# Altium schematic sheet 10-JTAG.SchDoc
size C; SheetNumber: 10; SheetTotal: 20
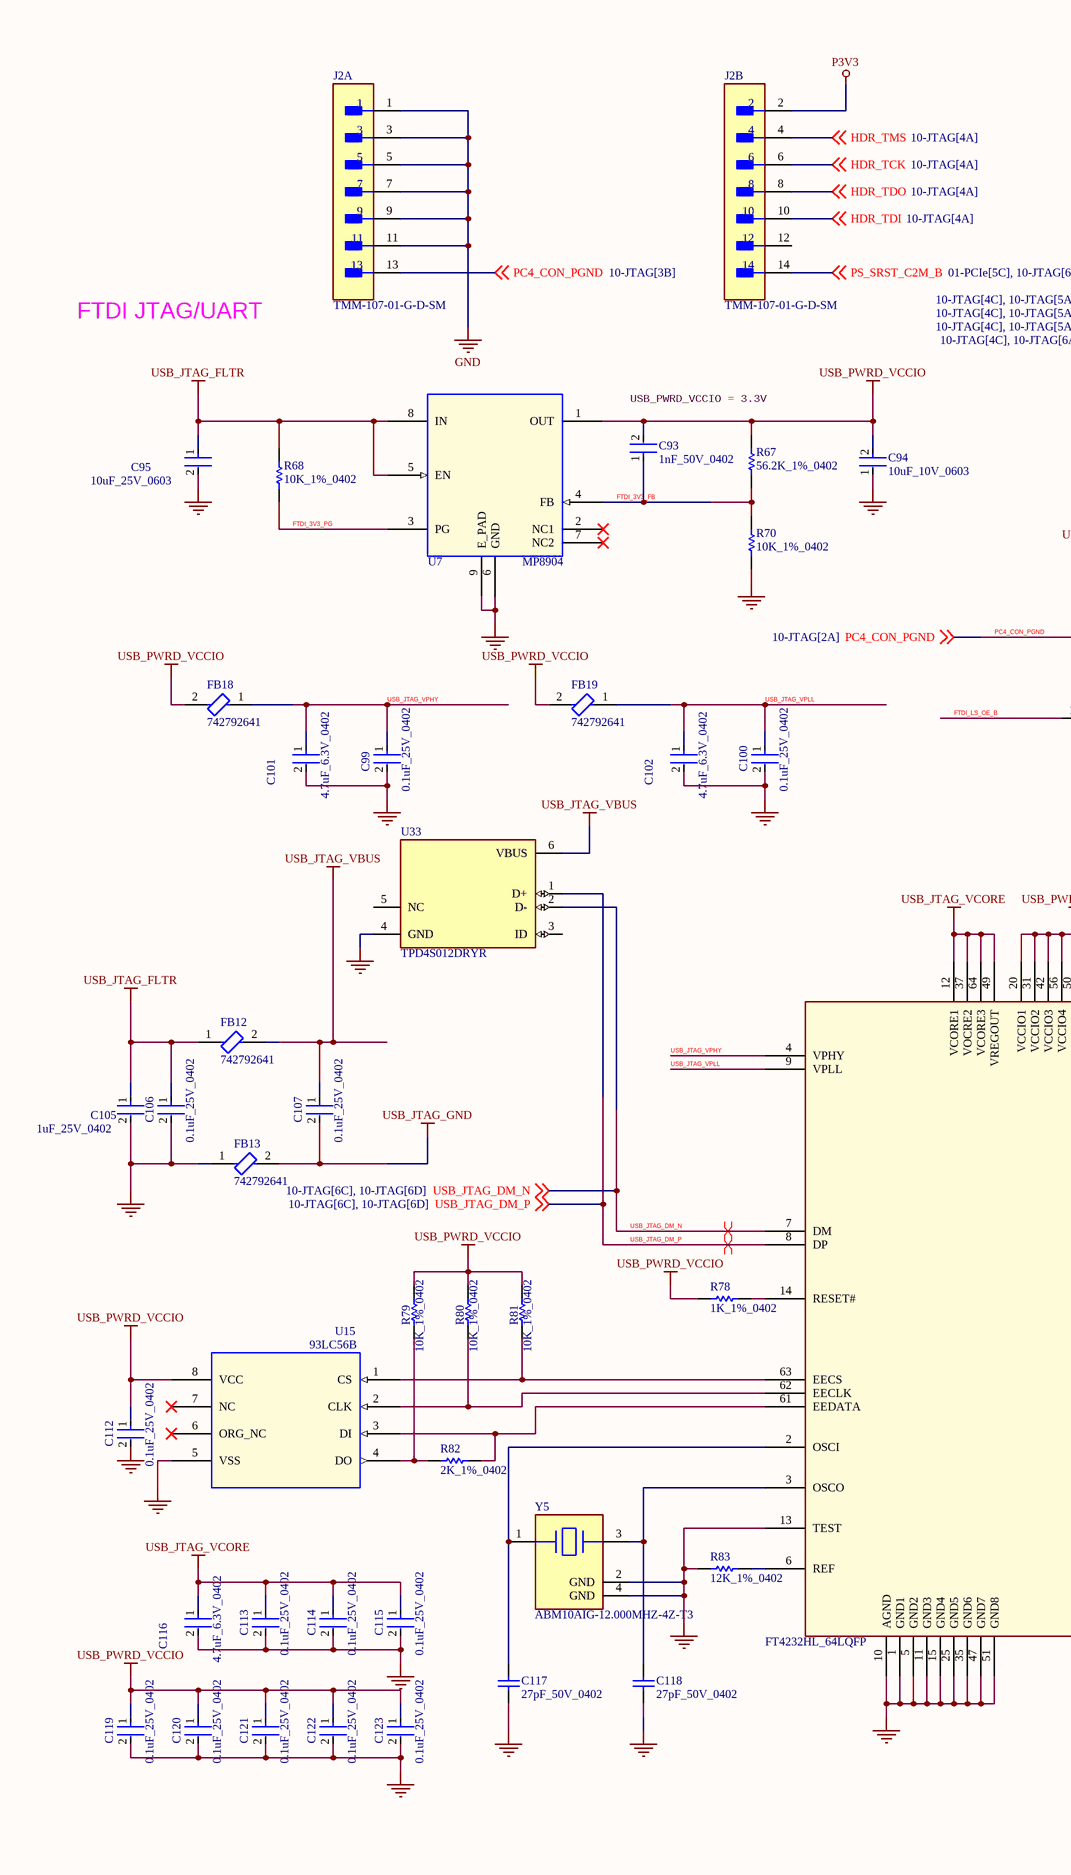
[diagram p0: 10-JTAG.SchDoc, left]
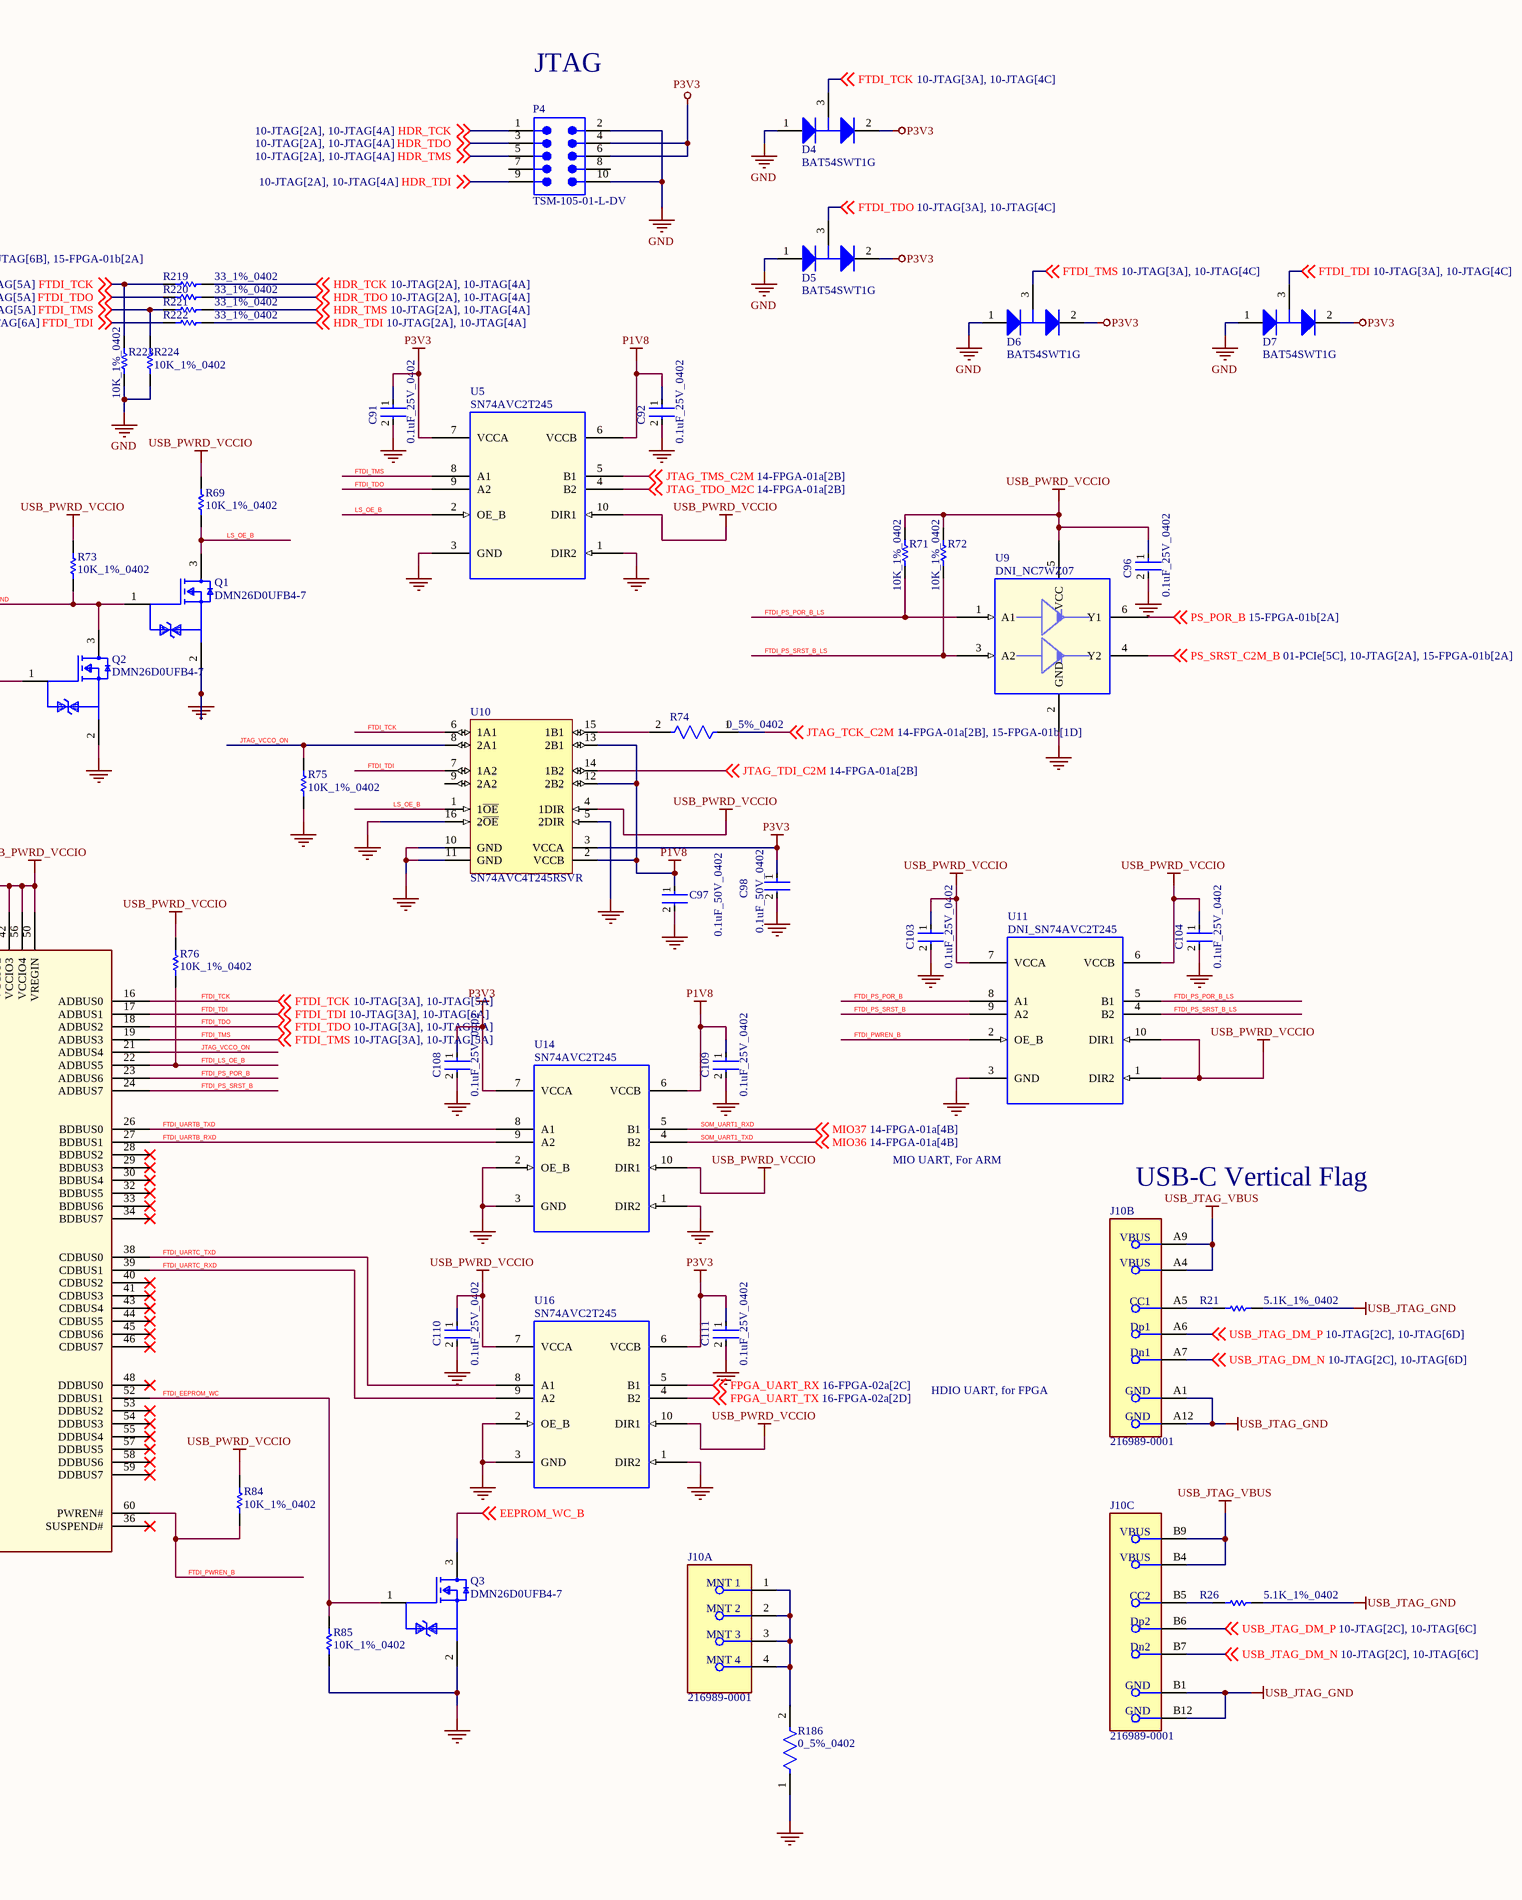
[diagram p1: 10-JTAG.SchDoc, right]

## Parts
C91  0.1uF_25V_0402  [FP-0402-L_1_0_1-W_0_5_0_1-IPC_C]
C92  0.1uF_25V_0402  [FP-0402-L_1_0_1-W_0_5_0_1-IPC_C]
C93  1nF_50V_0402  [FP-CGA2B-MFG]
C94  10uF_10V_0603  [FP-C1608-080-0_1-MFG]
C95  10uF_25V_0603  [FP-CL10-IPC_C]
C96  0.1uF_25V_0402  [FP-0402-L_1_0_1-W_0_5_0_1-IPC_C]
C97  0.1uF_50V_0402  [FP-C1005-050-0_05-IPC_C]
C98  0.1uF_50V_0402  [FP-C1005-050-0_05-IPC_C]
C99  0.1uF_25V_0402  [FP-0402-L_1_0_1-W_0_5_0_1-IPC_C]
C100  0.1uF_25V_0402  [FP-0402-L_1_0_1-W_0_5_0_1-IPC_C]
C101  4.7uF_6.3V_0402  [FP-C1005-050-0_15-IPC_C]
C102  4.7uF_6.3V_0402  [FP-C1005-050-0_15-IPC_C]
C103  0.1uF_25V_0402  [FP-0402-L_1_0_1-W_0_5_0_1-IPC_C]
C104  0.1uF_25V_0402  [FP-0402-L_1_0_1-W_0_5_0_1-IPC_C]
C105  1uF_25V_0402  [FP-CL542-IPC_C]
C106  0.1uF_25V_0402  [FP-0402-L_1_0_1-W_0_5_0_1-IPC_C]
C107  0.1uF_25V_0402  [FP-0402-L_1_0_1-W_0_5_0_1-IPC_C]
C108  0.1uF_25V_0402  [FP-0402-L_1_0_1-W_0_5_0_1-IPC_C]
C109  0.1uF_25V_0402  [FP-0402-L_1_0_1-W_0_5_0_1-IPC_C]
C110  0.1uF_25V_0402  [FP-0402-L_1_0_1-W_0_5_0_1-IPC_C]
C111  0.1uF_25V_0402  [FP-0402-L_1_0_1-W_0_5_0_1-IPC_C]
C112  0.1uF_25V_0402  [FP-0402-L_1_0_1-W_0_5_0_1-IPC_C]
C113  0.1uF_25V_0402  [FP-0402-L_1_0_1-W_0_5_0_1-IPC_C]
C114  0.1uF_25V_0402  [FP-0402-L_1_0_1-W_0_5_0_1-IPC_C]
C115  0.1uF_25V_0402  [FP-0402-L_1_0_1-W_0_5_0_1-IPC_C]
C116  4.7uF_6.3V_0402  [FP-C1005-050-0_15-IPC_C]
C117  27pF_50V_0402  [CAPC1005X55X25LL05T10]
C118  27pF_50V_0402  [CAPC1005X55X25LL05T10]
C119  0.1uF_25V_0402  [FP-0402-L_1_0_1-W_0_5_0_1-IPC_C]
C120  0.1uF_25V_0402  [FP-0402-L_1_0_1-W_0_5_0_1-IPC_C]
C121  0.1uF_25V_0402  [FP-0402-L_1_0_1-W_0_5_0_1-IPC_C]
C122  0.1uF_25V_0402  [FP-0402-L_1_0_1-W_0_5_0_1-IPC_C]
C123  0.1uF_25V_0402  [FP-0402-L_1_0_1-W_0_5_0_1-IPC_C]
D4  BAT54SWT1G  [ONSC-SOT-323-3-419-04_V]
D5  BAT54SWT1G  [ONSC-SOT-323-3-419-04_V]
D6  BAT54SWT1G  [ONSC-SOT-323-3-419-04_V]
D7  BAT54SWT1G  [ONSC-SOT-323-3-419-04_V]
FB12  742792641  [FP-742792641-MFG]
FB13  742792641  [FP-742792641-MFG]
FB18  742792641  [FP-742792641-MFG]
FB19  742792641  [FP-742792641-MFG]
J2  TMM-107-01-G-D-SM  [FP-TMM-107-01-G-D-SM-MFG]  (parts A,B of 2)
J10  216989-0001  [FP-216989-0001-MFG]  (parts A,B,C of 3)
P4  TSM-105-01-L-DV  [SMTC-TSM-105-01-X-DV]
Q1  DMN26D0UFB4-7  [FP-X2-DFN1006-3-MFG]
Q2  DMN26D0UFB4-7  [FP-X2-DFN1006-3-MFG]
Q3  DMN26D0UFB4-7  [FP-X2-DFN1006-3-MFG]
R21  5.1K_1%_0402  [RESC1005X40X25ML10T10]
R26  5.1K_1%_0402  [RESC1005X40X25ML10T10]
R67  56.2K_1%_0402  [RESC1005X40X25LL05T05]
R68  10K_1%_0402  [RESC1005X40X25ML05T05]
R69  10K_1%_0402  [RESC1005X40X25ML05T05]
R70  10K_1%_0402  [RESC1005X40X25ML05T05]
R71  10K_1%_0402  [RESC1005X40X25ML05T05]
R72  10K_1%_0402  [RESC1005X40X25ML05T05]
R73  10K_1%_0402  [RESC1005X40X25ML05T05]
R74  0_5%_0402  [FP-AC0402-0_37-IPC_B]
R75  10K_1%_0402  [RESC1005X40X25ML05T05]
R76  10K_1%_0402  [RESC1005X40X25ML05T05]
R78  1K_1%_0402  [RESC1005X40X25NL05T05]
R79  10K_1%_0402  [RESC1005X40X25ML05T05]
R80  10K_1%_0402  [RESC1005X40X25ML05T05]
R81  10K_1%_0402  [RESC1005X40X25ML05T05]
R82  2K_1%_0402  [RESC1005X40X25LL10T10]
R83  12K_1%_0402  [RESC1005X40X25ML10T10]
R84  10K_1%_0402  [RESC1005X40X25ML05T05]
R85  10K_1%_0402  [RESC1005X40X25ML05T05]
R186  0_5%_0402  [FP-AC0402-0_37-IPC_B]
R219  33_1%_0402  [RESC1005X40X25NL05T10]
R220  33_1%_0402  [RESC1005X40X25NL05T10]
R221  33_1%_0402  [RESC1005X40X25NL05T10]
R222  33_1%_0402  [RESC1005X40X25NL05T10]
R223  10K_1%_0402  [RESC1005X40X25ML05T05]
R224  10K_1%_0402  [RESC1005X40X25ML05T05]
U5  SN74AVC2T245  [QFN40P140X180X55-10]
U7  MP8904  [QFN_MP8904DD_8]
U9  DNI_NC7WZ07  [SC70_6]
U10  SN74AVC4T245RSVR  [RSV0016A_V]
U11  DNI_SN74AVC2T245  [QFN40P140X180X55-10]  (no BOM)
U13  FT4232HL_64LQFP  [LQFP_64]
U14  SN74AVC2T245  [QFN40P140X180X55-10]
U15  93LC56B  [SOIC8P127W390]
U16  SN74AVC2T245  [QFN40P140X180X55-10]
U33  TPD4S012DRYR  [FP-DRY0006A-MFG]
Y5  ABM10AIG-12.000MHZ-4Z-T3  [FP-ABM10AIG-MFG]

## Nets
GND: C91.2 C92.2 C94.1 C95.2 C96.2 C97.2 C98.2 C99.2 C100.2 C101.2 C102.2 C103.2 C104.2 C105.2 C106.2 C108.2 C109.2 C110.2 C111.2 C112.2 C113.2 C114.2 C115.2 C116.2 C117.1 C118.1 C119.2 C120.2 C121.2 C122.2 C123.2 D4.1(A) D5.1(A) D6.1(A) D7.1(A) FB13.1 J2.1 J2.3 J2.5 J2.7 J2.9 J2.11 P4.2 P4.10 Q1.2(S) Q2.2(S) Q3.2(S) R70.1 R75.1 R83.1 R85.1 R186.1 R223.1 R224.1 U5.1(DIR2) U5.3(GND) U7.6(GND) U7.9(E_PAD) U9.2(GND) U10.5(2DIR) U10.10(GND) U10.11(GND) U10.16(2~{OE}) U11.3(GND) U13.1(GND1) U13.5(GND2) U13.10(AGND) U13.11(GND3) U13.13(TEST) U13.15(GND4) U13.25(GND5) U13.35(GND6) U13.47(GND7) U13.51(GND8) U14.1(DIR2) U14.2(OE_B) U14.3(GND) U15.5(VSS) U16.1(DIR2) U16.2(OE_B) U16.3(GND) U33.4(GND) Y5.2(GND) Y5.4(GND)
P1V8: C92.1 C97.1 C109.1 U5.6(VCCB) U10.2(VCCB) U10.12(2B2) U10.13(2B1) U14.6(VCCB)
P3V3: C91.1 C98.1 C108.1 C111.1 D4.2(K) D5.2(K) D6.2(K) D7.2(K) J2.2 P4.4 P4.6 U5.7(VCCA) U10.3(VCCA) U14.7(VCCA) U16.6(VCCB)
USB_JTAG_FLTR: C95.1 C105.1 C106.1 FB12.1 R68.2 U7.5(EN) U7.8(IN)
USB_JTAG_GND: C107.2 FB13.2 J10.A1(GND) J10.A12(GND) J10.B1(GND) J10.B12(GND) R21.2 R26.2
USB_JTAG_VBUS: C107.1 FB12.2 J10.A4(VBUS) J10.A9(VBUS) J10.B4(VBUS) J10.B9(VBUS) U33.6(VBUS)
USB_JTAG_VCORE: C113.1 C114.1 C115.1 C116.1 U13.12(VCORE1) U13.37(VOCRE2) U13.49(VREGOUT) U13.64(VCORE3)
USB_PWRD_VCCIO: C93.2 C94.2 C96.1 C103.1 C104.1 C110.1 C112.1 C119.1 C120.1 C121.1 C122.1 C123.1 FB18.2 FB19.2 R67.2 R69.2 R71.2 R72.2 R73.2 R76.2 R78.1 R79.2 R80.2 R81.2 R84.2 U5.10(DIR1) U7.1(OUT) U9.5(VCC) U10.4(1DIR) U11.1(DIR2) U11.6(VCCB) U11.7(VCCA) U11.10(DIR1) U13.20(VCCIO1) U13.31(VCCIO2) U13.42(VCCIO3) U13.50(VREGIN) U13.56(VCCIO4) U14.10(DIR1) U15.8(VCC) U16.7(VCCA) U16.10(DIR1)
EEPROM_WC_B: Q3.3(D) ; off-sheet EEPROM_WC_B
FPGA_UART_RX: U16.5(B1) ; off-sheet FPGA_UART_RX
FPGA_UART_TX: U16.4(B2) ; off-sheet FPGA_UART_TX
FTDI_3V3_FB: C93.1 R67.1 R70.2 U7.4(FB)
FTDI_3V3_PG: R68.1 U7.3(PG)
FTDI_EEPROM_WC: Q3.1(G) R85.2 U13.52(DDBUS1)
FTDI_LS_OE_B: Q2.1(G) R76.1 U13.22(ADBUS5)
FTDI_PS_POR_B: U11.8(A1) U13.23(ADBUS6)
FTDI_PS_POR_B_LS: R71.1 U9.1(A1) U11.5(B1)
FTDI_PS_SRST_B: U11.9(A2) U13.24(ADBUS7)
FTDI_PS_SRST_B_LS: R72.1 U9.3(A2) U11.4(B2)
FTDI_PWREN_B: R84.1 U11.2(OE_B) U13.60(PWREN#)
FTDI_TCK: D4.3(K/A) R219.1 R223.2 U10.6(1A1) U13.16(ADBUS0) ; off-sheet FTDI_TCK
FTDI_TDI: D7.3(K/A) R222.1 U10.7(1A2) U13.17(ADBUS1) ; off-sheet FTDI_TDI
FTDI_TDO: D5.3(K/A) R220.1 U5.9(A2) U13.18(ADBUS2) ; off-sheet FTDI_TDO
FTDI_TMS: D6.3(K/A) R221.1 R224.2 U5.8(A1) U13.19(ADBUS3) ; off-sheet FTDI_TMS
FTDI_UARTB_RXD: U13.27(BDBUS1) U14.9(A2)
FTDI_UARTB_TXD: U13.26(BDBUS0) U14.8(A1)
FTDI_UARTC_RXD: U13.39(CDBUS1) U16.9(A2)
FTDI_UARTC_TXD: U13.38(CDBUS0) U16.8(A1)
HDR_TCK: J2.6 P4.1 R219.2 ; off-sheet HDR_TCK
HDR_TDI: J2.10 P4.9 R222.2 ; off-sheet HDR_TDI
HDR_TDO: J2.8 P4.3 R220.2 ; off-sheet HDR_TDO
HDR_TMS: J2.4 P4.5 R221.2 ; off-sheet HDR_TMS
JTAG_TCK_C2M: R74.1 ; off-sheet JTAG_TCK_C2M
JTAG_TDI_C2M: U10.14(1B2) ; off-sheet JTAG_TDI_C2M
JTAG_TDO_M2C: U5.4(B2) ; off-sheet JTAG_TDO_M2C
JTAG_TMS_C2M: U5.5(B1) ; off-sheet JTAG_TMS_C2M
JTAG_VCCO_ON: R75.2 U10.8(2A1) U13.21(ADBUS4)
LS_OE_B: Q1.3(D) R69.1 U5.2(OE_B) U10.1(1~{OE})
PC4_CON_PGND: J2.13 Q1.1(G) Q2.3(D) R73.1 ; off-sheet PC4_CON_PGND
PS_POR_B: U9.6(Y1) ; off-sheet PS_POR_B
PS_SRST_C2M_B: J2.14 U9.4(Y2) ; off-sheet PS_SRST_C2M_B
SOM_UART1_RXD: U14.5(B1) ; off-sheet MIO37  [also labelled MIO37]
SOM_UART1_TXD: U14.4(B2) ; off-sheet MIO36  [also labelled MIO36]
USB_JTAG_DM_N: J10.A7(Dn1) J10.B7(Dn2) U13.7(DM) U33.2(D-) ; off-sheet USB_JTAG_DM_N
USB_JTAG_DM_P: J10.A6(Dp1) J10.B6(Dp2) U13.8(DP) U33.1(D+) ; off-sheet USB_JTAG_DM_P
USB_JTAG_VPHY: C99.1 C101.1 FB18.1 U13.4(VPHY)
USB_JTAG_VPLL: C100.1 C102.1 FB19.1 U13.9(VPLL)
NetC117_2: C117.2 U13.2(OSCI) Y5.1(1_Crystal)
NetC118_2: C118.2 U13.3(OSCO) Y5.3(2_Crystal)
NetJ10_1: J10.1(MNT_1) J10.2(MNT_2) J10.3(MNT_3) J10.4(MNT_4) R186.2
NetJ10_A5: J10.A5(CC1) R21.1
NetJ10_B5: J10.B5(CC2) R26.1
NetR74_2: R74.2 U10.15(1B1)
NetR78_2: R78.2 U13.14(RESET#)
NetR79_1: R79.1 R82.1 U15.4(DO)
NetR80_1: R80.1 U13.62(EECLK) U15.2(CLK)
NetR81_1: R81.1 U13.63(EECS) U15.1(CS)
NetR82_2: R82.2 U13.61(EEDATA) U15.3(DI)
NetR83_2: R83.2 U13.6(REF)

Not connected (* = marked no-connect by the designer): J2 12; P4 7 8; U7 2(NC1)* 7(NC2)*; U10 9(2A2); U13 28(BDBUS2)* 29(BDBUS3)* 30(BDBUS4)* 32(BDBUS5)* 33(BDBUS6)* 34(BDBUS7)* 36(SUSPEND#)* 40(CDBUS2)* 41(CDBUS3)* 43(CDBUS4)* 44(CDBUS5)* 45(CDBUS6)* 46(CDBUS7)* 48(DDBUS0)* 53(DDBUS2)* 54(DDBUS3)* 55(DDBUS4)* 57(DDBUS5)* 58(DDBUS6)* 59(DDBUS7)*; U15 6(ORG_NC)* 7(NC)*; U33 3(ID) 5(NC)

## Layout directives
differential pair: USB_JTAG_DM_N, USB_JTAG_DM_P

## Notes on the sheet
- JTAG
- FTDI JTAG/UART
- USB_PWRD_VCCIO = 3.3V
- MIO UART, For ARM
- USB-C Vertical Flag
- HDIO UART, for FPGA

## Library data of the parts
C91 C92 C96 C99 C100 C103 C104 C106-C115 C119-C123 = CMP-2008-02519-2: General Purpose Ceramic Capacitor, 0402, 100nF, 10%, X7R, 15%, 25V; Package Quantity: 1; Capacitance: 100nF; Min Operating Temperature: -55°C; Voltage: 25V; Voltage Rating: 25V; Construction: Flat; Max Operating Temperature: 125°C; Radiation Hardening: No; Depth: 0.5mm; Thickness: 0.022inch; Voltage Rating (DC): 25V; Number of Pins: 2; Lead Free: Lead Free; Series: -; REACH SVHC: No SVHC; Length: 1mm; Dielectric: X7R; RoHS Compliant: Yes; Mount: Surface Mount; Packaging: Tape and Reel; Case/Package: 0402; Case Code (Imperial): 0402; Termination: SMD/SMT; Width: 0.02inch; Case Code (Metric): 1005; Tolerance: 10%
C93 = CMP-08246-002303-1: Cap Ceramic 1nF 50V X7R 10% Pad SMD 0402 +125°C Automotive T/R; Width: 0.02inch; Thickness: 0.022inch; Min Operating Temperature: -55°C; Mount: Surface Mount; Voltage Rating (DC): 50V; Voltage Rating: 50V; Termination: SMD/SMT; Capacitance: 1nF; Case/Package: 0402; Depth: 0.5mm; Length: 1mm; Ratings: AEC-Q200; Height: 0.5mm; Dielectric: X7R; Radiation Hardening: No; Lead Free: Lead Free; Composition: Ceramic; Max Operating Temperature: 125°C; Case Code (Imperial): 0402; Tolerance: 10%; Case Code (Metric): 1005; REACH SVHC: No SVHC; Package Quantity: 1; Packaging: Tape and Reel; Weight: 2.3E-05oz
C94 = CMP-2000-04979-3: Multilayer Ceramic Capacitors 10μF ±10% 10V X5R SMD 0603; Capacitance: 10uF; Dielectric Material: Ceramic; Construction: Flat; Height: 0.8mm; Thickness: 0.035inch; Case Code (Metric): 1608; Radiation Hardening: No; Number of Pins: 2; Voltage Rating (DC): 10V; Depth: 0.8mm; Voltage: 10V; RoHS Compliant: Yes; Voltage Rating: 10V; Package Quantity: 1; Resistor Type: Ceramic; Termination: SMD/SMT; Lead Free: Lead Free; REACH SVHC: No SVHC; Tolerance: 10%; Mount: Surface Mount; Series: C; Packaging: Tape and Reel; Width: 0.8mm; Dielectric: X5R; Weight: 7.1E-05oz; Length: 1.6mm; Max Operating Temperature: 85°C; Case Code (Imperial): 0603; Case/Package: 0603; Min Operating Temperature: -55°C
C95 = CMP-13271-004224-1: Cap Ceramic 10uF 25V X5R ±20% Pad SMD 0603 +85°C T/R; Width: 0.031inch; Voltage Rating: 25V; Length: 0.063inch; Case Code (Metric): 1608; Dielectric: X5R; Termination: Wraparound; Capacitance: 10uF; Lead Free: Lead Free; Mount: Surface Mount; Package Quantity: 1; Case Code (Imperial): 0603; Thickness: 0.035inch; Packaging: Tape and Reel; Contact Plating: Tin; Min Operating Temperature: -55°C; Tolerance: 20%; Max Operating Temperature: 85°C; Case/Package: 0603
C97 C98 = CMP-2000-05393-2: Multilayer Ceramic Capacitors 100nF ±10% 50V X7R SMD 0402; Voltage: 50V; Dielectric Material: Ceramic; Min Operating Temperature: -55°C; Depth: 0.5mm; Radiation Hardening: No; RoHS Compliant: Yes; Voltage Rating (DC): 50V; Lead Free: Lead Free; Resistor Type: Ceramic; Height: 0.5mm; Dielectric: X7R; Thickness: 0.022inch; Case/Package: 0402; Case Code (Metric): 1005; Termination: SMD/SMT; Capacitance: 100nF; Packaging: Tape and Reel; Max Operating Temperature: 125°C; Mount: Surface Mount; Package Quantity: 1; Width: 0.02inch; Weight: 2.3E-05oz; Voltage Rating: 50V; Tolerance: 10%; Construction: Flat; Case Code (Imperial): 0402; Length: 1mm; REACH SVHC: No SVHC; Series: C
C101 C102 C116 = CMP-08246-005457-1: CAP CER 4.7UF 6.3V X5R 0402; Dissipation Factor: 10%; Tolerance: 20%; Dielectric Material: Ceramic; Min Operating Temperature: -55°C; Construction: Flat; Voltage Rating (DC): 6.3V; Case Code (Metric): 1005; Voltage: 6.3V; Thickness: 0.026inch; Lead Free: Lead Free; Weight: 2.3E-05oz; Height: 0.5mm; Series: C; Case/Package: 0402; Capacitance: 4.7uF; Dielectric: X5R; Case Code (Imperial): 0402; Width: 0.02inch; Radiation Hardening: No; Packaging: Tape and Reel; Resistor Type: Ceramic; Termination: SMD/SMT; Max Operating Temperature: 85°C; REACH SVHC: No SVHC; Mount: Surface Mount; Package Quantity: 1; Length: 1mm; Voltage Rating: 6.3V; Depth: 0.5mm
C105 = CMP-13271-001051-1: Cap Ceramic 1uF 25V X5R ±10% SMD 0402 +85°C Paper T/R; Radiation Hardening: No; Lead Free: Lead Free; Capacitance: 1uF; Package Quantity: 10000; Max Operating Temperature: 85°C; Voltage Rating: 25V; Case/Package: 0402; Min Operating Temperature: -55°C; Packaging: Tape and Reel; Tolerance: 10%; Height: 0.5mm; Thickness: 0.022inch; Case Code (Metric): 1005; Width: 0.02inch; Case Code (Imperial): 0402; Dielectric: X5R; Length: 1mm; Mount: Surface Mount; Material: Ceramic; Depth: 0.5mm
C117 C118 = CMP-2008-03917-1: Part Number: GRM1555C1H270JA01D; Manufacturer: Murata
D4-D7 = CMP-1055-00559-1: Dual Series Schottky Barrier Diodes, 3-Pin SOT-323, Pb-Free, Tape and Reel; Manufacturer: On Semiconductor; trr Max (ns): 5; IFSM Max (A): 0.6; ComponentLink1URL: http://www.onsemi.com/; Mounting Technology: Surface Mount; ComponentLink1Description: Manufacturer URL; ComponentLink3URL: http://www.onsemi.com/pub_link/Collateral/419-04.PDF; RoHS: TRUE; PackageVersion: Rev. N, 11/2008; Packing: Tape and Reel; PackageReference: SOT-323-3-419-04; ComponentLink2URL: http://www.onsemi.cn/pub_link/Collateral/BAT54SWT1-D.PDF; ComponentLink3Description: Package Specification; PackageDescription: 3-Pin Small Outline Transistor, Body 2 x 1.25 mm, Pitch 0.65 mm; ComponentLink2Description: Datasheet; PartNumber: BAT54SWT1G; DatasheetVersion: Rev. 10; Configuration: Dual
FB12 FB13 FB18 FB19 = CMP-0220-00171-2: FERRITE BEAD 300 OHM 0603 1LN; Inductance: 18nH; Max DC Current: 2A; Number of Lines: 1; Test Frequency: 100MHz; Impedance: 300R; DC Resistance (DCR): 150mR; Tolerance: 25%; Case Code (Metric): 1608; Core Material: Ferrite; Length: 1.6mm; Lead Free: Lead Free; Series: WE-CBF; Min Operating Temperature: -55°C; RoHS Compliant: Yes; Case/Package: SMD/SMT; Material: Ferrite; Max Operating Temperature: 125°C; Termination: SMD/SMT; Packaging: Tape and Reel; Weight: 0.000141oz; Case Code (Imperial): 0603; Width: 0.8mm; Mount: Surface Mount; Max Current Rating: 2A; Package Quantity: 1; Depth: 0.8mm; Current Rating: 2A; Height: 0.8mm
J2 = CMP-02766-001657-1: CONN HEADER SMD 14POS 2MM; Number of Positions: 14; Max Current Rating: 3.9A; Connector Type: Male Pin; Max Voltage Rating (AC): 500V; Gender: Male; Row Spacing: 0.079inch; Max Operating Temperature: 125°C; Contact Type: Male Pin; Contact Plating: Gold; Length: 14mm; Color: Black; Contact Mating Length: 0.126inch; Radiation Hardening: No; Lead Pitch: 2mm; Series: TMM; Housing Color: Black; Depth: 3.94mm; Package Quantity: 41; REACH SVHC: No SVHC; Number of Contacts: 14; Lead Free: Lead Free; Number of Rows: 2; Contact Material: Bronze; Pitch: 2mm; Mount: Surface Mount; Min Operating Temperature: -55°C; Orientation: Straight; Current Rating: 3.9A; Packaging: Bulk; Termination: Solder; Housing Material: Polymer; Voltage Rating: 500V
J10 = CMP-04767-000020-1: CONN RCPT USB2.0 TYPE C 24POS RA
P4 = CMP-1024-00233-1: 0.025" SQ Post Header, Surface Mount, Vertical, -55 to 125 degC, 2.54 mm Pitch, 10-Pin, Male, RoHS; Manufacturer: Samtec; Pitch: 2.54 mm; ComponentLink1URL: http://www.samtec.com; DatasheetVersion: F-214; ComponentLink3URL: http://www.samtec.com/documents/webfiles/cpdf/TSM-1XX-XX-XXX-XX-X-XXX-X-MKT.pdf; Temperature Range: -55 to 125 degC; PackageDescription: Double Row Gullwing ASM; PartNumber: TSM-105-01-L-DV; ComponentLink2URL: http://www.samtec.com/documents/webfiles/pdf/TSM.PDF; ComponentLink2Description: Datasheet; Mounting Technology: Surface Mount; PackageVersion: DJ, 4/1991; RoHS: True; ComponentLink3Description: Package Specification; PackageReference: TSM-105-01-X-DV; Orientation: Vertical; ComponentLink1Description: Manufacturer URL
Q1-Q3 = CMP-12801-000049-1: MOSFET N-CH 20V 230MA DFN; Manufacturer: Diodes Inc.; Threshold Vgs Max: 0.9V; Input Capacitace At Vds: 14.1pF @ 15V; Depletion Mode: False; Pulse Drain Current: 805mA; Threshold Vgs Min: 0.6V; Gate To Source Voltage: 10V; Max Junction Temp: +150°C; Turn On Delay Time: 3.8ns; Automotive Grade: Grade 0; Turn Off Delay Time: 13.4ns; Power Dissipation: 350mW; Standoff Height: 0mm; Transconductance: 0.242S; Number Of N Channels: 1; Drain To Source Resistance: 1.8Ω; Continuous Drain Current: 240mA; Max Forward Diode Voltage: 1.4V; Rthja Max: 357°C/W; Device Class L3: MOSFETs; Temperature: -55°C to +150°C; Footprint Url: https://www.diodes.com/assets/Package-Files/X2-DFN1006-3.pdf; Mouser Description: MOSFET ENHANCE MODE MOSFET 20V N-Chan; Device Class L1: Discrete Semiconductors; Height: 0.4mm; RoHS: TRUE; Digikey Description: MOSFET N-CH 20V 230MA DFN; Temperature Range Low: -55°C; Category: Trans; Temperature Range High: +150°C; Automotive: Yes; Drain To Source Voltage: 20V; ComponentLink2URL: https://www.diodes.com/assets/Datasheets/ds31775.pdf; Drain To Source Breakdown Voltage: 20V; ComponentLink2Description: Datasheet; Device Class L2: Transistors; Octopart: https://octopart.com/dmn26d0ufb4-7-diodes+inc.-17947794; Package: X2-DFN1006-3; Lead Free: Yes; Manufacturer Part Number: DMN26D0UFB4-7; Number Of Channels: 1
R21 R26 = CMP-2002-04046-1: Manufacturer: KOA Speer; Part Number: RK73H1ETTP5101F
R67 = CMP-2002-00996-1: Part Number: ERJ-2RKF5622X; Manufacturer: Panasonic
R68-R73 R75 R76 R79-R81 R84 R85 R223 R224 = CMP-2002-00433-1: Part Number: ERJ-2GEJ103X; Manufacturer: Panasonic
R74 R186 = CMP-2002-01772-2: RESISTOR 0402 JUMPER ZERO OHM; Voltage Rating: 50V; Temperature Coefficient: 200ppm/°C; Tolerance: 1%; Power Rating: 62.5mW; Resistance: 0R; Min Operating Temperature: -55°C; Termination: SMD/SMT; Case/Package: 0402; Case Code (Imperial): 0402; Packaging: Tape and Reel; Case Code (Metric): 1005; Max Operating Temperature: 155°C; Series: AC
R78 = CMP-2002-08277-1: Manufacturer: Vishay Dale; Part Number: CRCW04021K00FKTD
R82 = CMP-2002-06093-1: Manufacturer: Multicomp; Part Number: MC00625W040212K
R83 = CMP-2002-03841-1: Manufacturer: KOA Speer; Part Number: RK73H1ETTP1202F
R219-R222 = CMP-2002-07881-1: Part Number: RC0402FR-1333RL; Manufacturer: Yageo
U5 U11 U14 U16 = SN74AVC2T245: IC Lvl Trans 2-Bit Bidir 500Mbps 1.2-3.6V 50mA UQFN-10; Manufacturer PN: SN74AVC2T245RSWR; Manufacturer: TEXAS INSTRUMENTS; Agile Part Number: ICS-00048-01; EDMVersionID: 493023062; Barcode: 500012; PCB Footprint: QFN40P140X180X55-10; CIP Link: http://xsjbrdwin1/CIP-E/Component/Index/All?pn=500012; Part Type: BUS TRANSCEIVER
U7 = MP8904: IC LDO 6.5V 500mA Adj QFN-8; Manufacturer PN: MP8904DD-LF-Z; Manufacturer: Monolithic Power Systems Inc.; Agile Part Number: ICS-00581-01; EDMVersionID: 491667633; Barcode: 96000022; Datasheet: https://www.monolithicpower.com/pub/media/document/MP8904_r1.02.pdf; PCB Footprint: QFN_MP8904DD_8; Part Type: LDO; CIP Link: http://xsjbrdwin1/CIP-E/Component/Index/All?pn=96000022
U9 = NC7WZ07: IC Buffer Dual 5V 50mA 3.9nSec SC70-6 Open Drain; Manufacturer PN: NC7WZ07P6X; Manufacturer: ON Semiconductor; Agile Part Number: ICS-00102-01; Barcode: 500086; CIP Link: http://xsjbrdwin1/CIP-E/Component/Index/All?pn=500086; Part Type: CMOS LOGIC; ROHS: Yes; Family: CMOS LOGIC; PCB Footprint: SC70_6
U10 = CMP-2000-07132-1: Dual-Bit Bus Transceiver with Configurable Voltage Translation and 3-State Output, 1.2 to 3.6 V, -40 to 85 degC, 16-Pin UQFN (RSV), Green (RoHS & no Sb/Br), Tape and Reel; Manufacturer: Texas Instruments; Propagation Delay Time: 10.3ns; Polarity: Non-Inverting; Low Level Output Current: 12mA; High Level Output Current: -12mA; Quiescent Current: 80uA; Logic Family: AVC; Input Logic Level: CMOS; Number of  Elements: 2; Number of Channels: 4; Operating Supply Voltage (Typ): 1.8/2.5/3.3V; Operating Supply Voltage (Min): 1.2V; Operating Supply Voltage (Max): 3.6V; Technology: CMOS; Package Type: uQFN; Manufacturer URL: http://www.ti.com/; Packaging: TapeandReel; Package URL: http://www.ti.com/lit/ml/mpqf205c/mpqf205c.pdf; Pin Count: 16; Operating Temperature (Max): 85C; Mounting: SurfaceMount; Operating Temperature (Min): -40C; Operating Temperature Classification: Industrial; Package Reference: RSV0016A; Mounting Technology: SurfaceMount; Datasheet Version: Rev. G, 11/2014; Operating Temp Range: -40Cto85C; Rad Hardened: No; Datasheet URL: http://www.ti.com/lit/ds/symlink/sn74avc4t245.pdf; Output Logic Level: CMOS; Output Type: 3-State; Package Description: 16-Pin Quad Flat No-lead Package, Body 1.8 x 2.6 mm, Pitch 0.4 mm
U13 = FT4232HL
U15 = 93LC56B: IC EEPROM 2Kb 128x16-Bit Serial 2MHz 2.5V SOIC-8; Manufacturer PN: 93LC56B-I/SN; Manufacturer: MICROCHIP; Agile Part Number: ICS-00335-01; Barcode: 500495; ROHS: YES; Family: MEMORY; Part Type: MEMORY; CIP Link: http://xsjbrdwin1/CIP-E/Component/Index/All?pn=500495; PCB Footprint: SOIC8P127W390
U33 = CMP-0326-00038-4: TVS DIODE 5.5V 6SON; Breakdown Voltage: 24V; Interface: USB; ESD Protection: Yes; Peak Pulse Power: 60W; Number of Circuits: 4; Polarity: Unidirectional; Capacitance: 15pF; Test Current: 1mA; Working Voltage: 19V; Min Breakdown Voltage: 6V; Peak Pulse Current: 3A; Operating Supply Voltage: 950mV; Max Operating Temperature: 85°C; Packaging: Tape and Reel; Termination: SMD/SMT; Number of Pins: 6; Radiation Hardening: No; Width: 1.05mm; REACH SVHC: No SVHC; Lead Free: Lead Free; Depth: 1mm; Package Quantity: 5000; Length: 1.45mm; Direction: Unidirectional; Min Operating Temperature: -40°C; Number of Channels: 4; Max Power Dissipation: 60W; Height: 0.55mm
Y5 = CMP-27762-011014-1: Crystal 12MHz ±30ppm 10pF SMD-4 2.5mm x 2mm Automotive; Frequency Stability: 50ppm; ESR (Equivalent Series Resistance): 150R; Max Operating Temperature: 125°C; Frequency Tolerance: 30ppm; Frequency: 12MHz; RoHS Compliant: Yes; Mount: Surface Mount; Packaging: Tape and Reel; Case/Package: SMD/SMT; Load Capacitance: 10pF; Min Operating Temperature: -40°C; Length: 0.098inch; Height: 0.024inch; Width: 0.079inch; Ratings: AEC-Q200